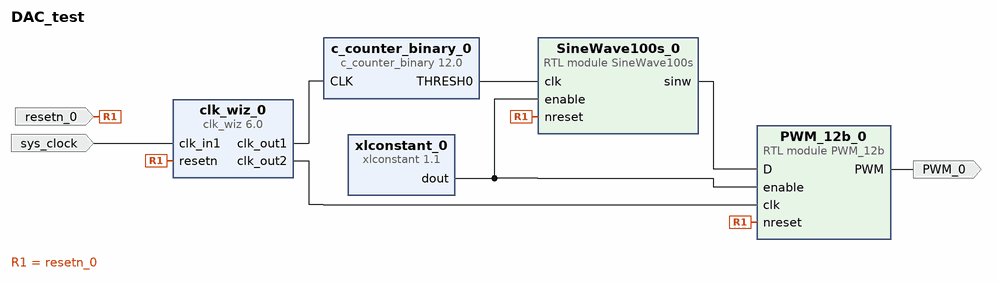
[diagram p0: block diagram of the top level]
# Vivado block design DAC_test, xc7a35ticsg324-1L, Vivado 2018.2
create_bd_design DAC_test

create_bd_port -dir I -type clk sys_clock
set_property -dict {CONFIG.FREQ_HZ 100000000 CONFIG.PHASE 0.000} [get_bd_ports sys_clock]
create_bd_port -dir I -type rst resetn_0
create_bd_port -dir O PWM_0

create_bd_cell -type ip -vlnv xilinx.com:ip:clk_wiz:6.0 clk_wiz_0
set_property -dict [list \
  CONFIG.PRIMITIVE PLL \
  CONFIG.CLKOUT2_USED true \
  CONFIG.NUM_OUT_CLKS 2 \
  CONFIG.CLKOUT1_REQUESTED_OUT_FREQ 12 \
  CONFIG.CLKOUT2_REQUESTED_OUT_FREQ 430 \
  CONFIG.CLKOUT1_DRIVES BUFG \
  CONFIG.CLKOUT2_DRIVES BUFG \
  CONFIG.CLKOUT3_DRIVES BUFG \
  CONFIG.CLKOUT4_DRIVES BUFG \
  CONFIG.CLKOUT5_DRIVES BUFG \
  CONFIG.CLKOUT6_DRIVES BUFG \
  CONFIG.CLKOUT7_DRIVES BUFG \
  CONFIG.RESET_PORT resetn \
  CONFIG.MMCM_DIVCLK_DIVIDE 1 \
  CONFIG.MMCM_CLKFBOUT_MULT_F 13 \
  CONFIG.MMCM_COMPENSATION ZHOLD \
  CONFIG.MMCM_CLKOUT0_DIVIDE_F 108 \
  CONFIG.MMCM_CLKOUT1_DIVIDE 3 \
  CONFIG.RESET_TYPE ACTIVE_LOW \
  CONFIG.USE_BOARD_FLOW true \
  CONFIG.CLK_IN1_BOARD_INTERFACE sys_clock \
  CONFIG.CLKOUT1_JITTER 172.617 \
  CONFIG.CLKOUT1_PHASE_ERROR 82.897 \
  CONFIG.CLKOUT2_JITTER 84.092 \
  CONFIG.CLKOUT2_PHASE_ERROR 82.897 \
] [get_bd_cells clk_wiz_0]
create_bd_cell -type module -reference PWM_12b PWM_12b_0
create_bd_cell -type ip -vlnv xilinx.com:ip:c_counter_binary:12.0 c_counter_binary_0
set_property -dict [list \
  CONFIG.Output_Width 11 \
  CONFIG.Restrict_Count true \
  CONFIG.Final_Count_Value 7D0 \
  CONFIG.Sync_Threshold_Output true \
  CONFIG.Threshold_Value 7D0 \
] [get_bd_cells c_counter_binary_0]
create_bd_cell -type module -reference SineWave100s SineWave100s_0
create_bd_cell -type ip -vlnv xilinx.com:ip:xlconstant:1.1 xlconstant_0

# ---- connections ----

connect_bd_net [get_bd_ports sys_clock] [get_bd_pins clk_wiz_0/clk_in1]
connect_bd_net [get_bd_pins clk_wiz_0/clk_out2] [get_bd_pins PWM_12b_0/clk]
connect_bd_net [get_bd_pins clk_wiz_0/clk_out1] [get_bd_pins c_counter_binary_0/CLK]
connect_bd_net [get_bd_pins c_counter_binary_0/THRESH0] [get_bd_pins SineWave100s_0/clk]
connect_bd_net -net resetn_0_1 [get_bd_ports resetn_0] \
  [get_bd_pins clk_wiz_0/resetn] [get_bd_pins PWM_12b_0/nreset] [get_bd_pins SineWave100s_0/nreset]
connect_bd_net [get_bd_pins xlconstant_0/dout] [get_bd_pins SineWave100s_0/enable] [get_bd_pins PWM_12b_0/enable]
connect_bd_net [get_bd_pins SineWave100s_0/sinw] [get_bd_pins PWM_12b_0/D]
connect_bd_net [get_bd_pins PWM_12b_0/PWM] [get_bd_ports PWM_0]

validate_bd_design
save_bd_design
